# Altium schematic sheet SAM_E54_Xplained_Pro_Ethernet.SchDoc: Ethernet
size A3; Organization: ATMEL Norway; Address1: Vestre Rosten 79; Address2: N-7075 TILLER; Address3: NORWAY; DocumentNumber: A09-2748; Revision: 4; SheetNumber: 7; SheetTotal: 13; PageSetup: Record=PageOptions|CenterHorizontal=True|CenterVertical=True|PrintScale=1.04|XCorrection=1.00|YCorrection=1.00|PrintKind=1|BorderSize=5000000|LeftOffset=0|BottomOffset=0|Orientation=2|PaperLength=1000|PaperWidth=1000|Scale=100|PaperSource=7|PrintQuality=-4|MediaType=1|DitherType=10|PrintScaleMode=1|PaperKind=A3 (297 x 420 mm)|PaperIndex=8
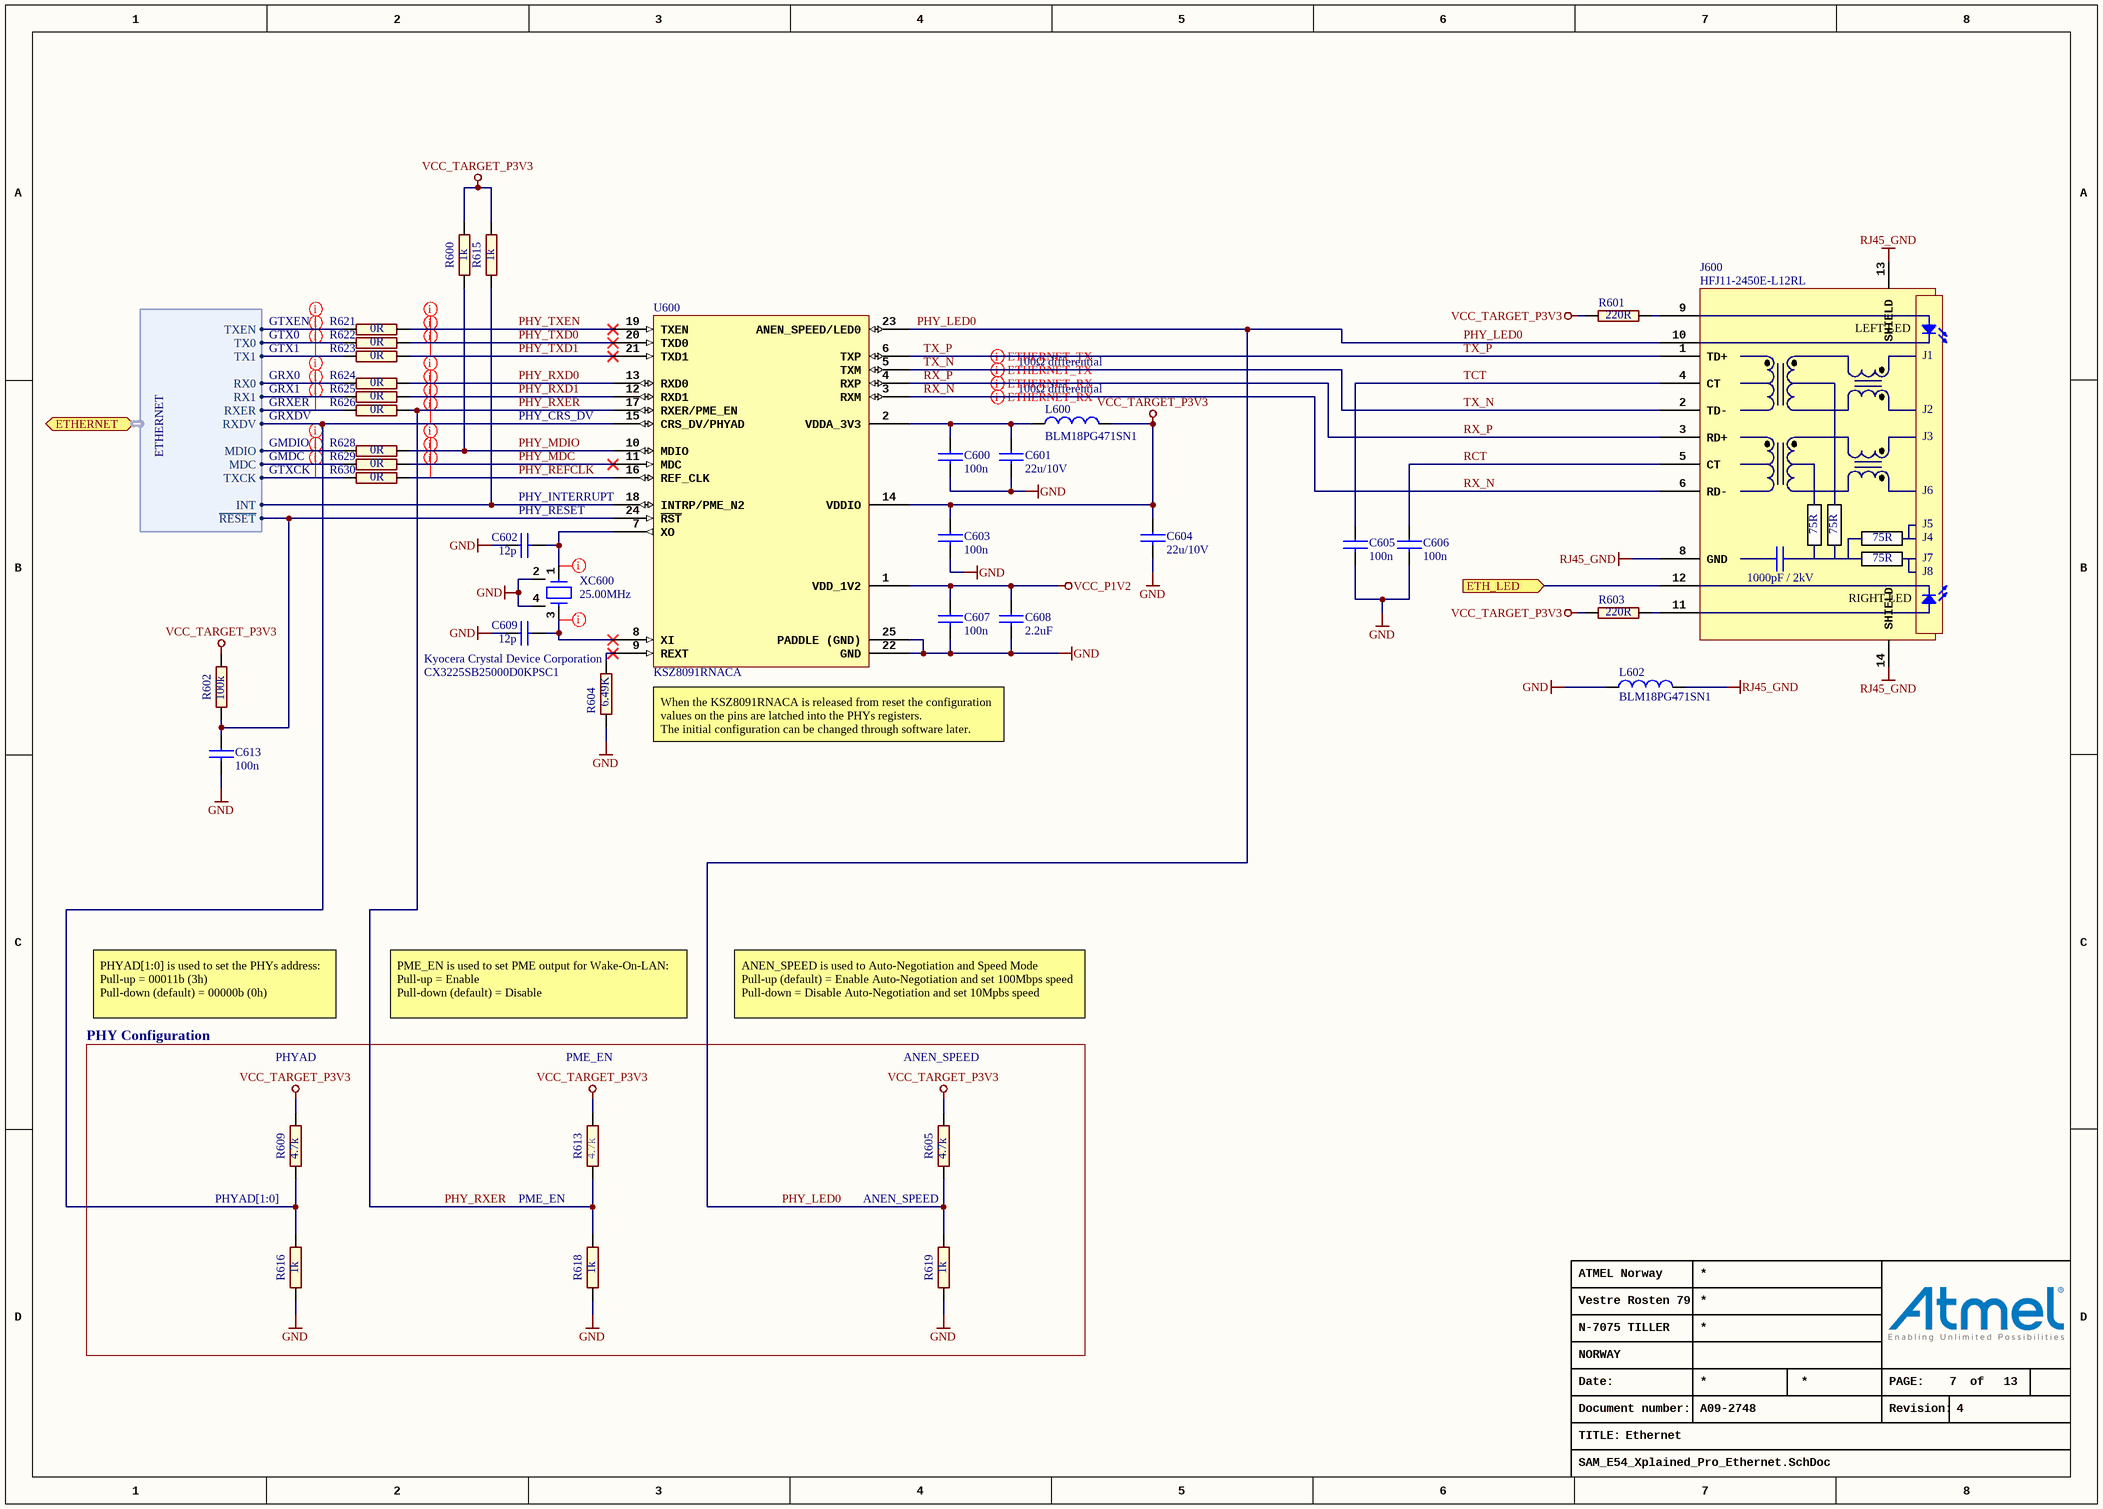
[diagram p0: SAM_E54_Xplained_Pro_Ethernet.SchDoc]

## Parts
C600  value 100n  [AP1-00053]
C601  value 22u/10V  [AP1-00117]
C602  value 12p  [AP1-00053]
C603  value 100n  [AP1-00053]
C604  value 22u/10V  [AP1-00117]
C605  value 100n  [AP1-00053]
C606  value 100n  [AP1-00053]
C607  value 100n  [AP1-00053]
C608  value 2.2uF  [AP1-00053]  (hidden comment: Farnell no: 1288200)
C609  value 12p  [AP1-00053]
C613  value 100n  [AP1-00053]
J600  value HFJ11-2450E-L12RL  [AP8-01033]
L600  value BLM18PG471SN1  [AP3-00005]
L602  value BLM18PG471SN1  [AP3-00005]
R600  value 1k  [AP2-00011]
R601  value 220R  [AP2-00011]
R602  value 100k  [AP2-00011]
R603  value 220R  [AP2-00011]
R604  value 6.49K  [AP2-00011]
R605  value 4.7k  [AP2-00011]
R609  value 4.7k  [AP2-00011]
R613  value 4.7k  [AP2-00011]
R615  value 1k  [AP2-00011]
R616  value 1k  [AP2-00011]
R618  value 1k  [AP2-00011]
R619  value 1k  [AP2-00011]
R621  value 0R  [AP2-00011]
R622  value 0R  [AP2-00011]
R623  value 0R  [AP2-00011]
R624  value 0R  [AP2-00011]
R625  value 0R  [AP2-00011]
R626  value 0R  [AP2-00011]
R628  value 0R  [AP2-00011]
R629  value 0R  [AP2-00011]
R630  value 0R  [AP2-00011]
U600  value KSZ8091RNACA  [AP6-00348]
XC600  value 25.00MHz  Manufacturer: Kyocera Crystal Device Corporation  MPN: CX3225SB25000D0KPSC1  [AP7-00061]

## Blocks framed on the sheet
PHY Configuration: R605 R609 R613 R616 R618 R619

## Ports
ETH_LED (in), ETHERNET (harness ETHERNET)

## Harnesses
ETHERNET: TX0, TX1, TXEN, TXCK, RX0, RX1, MDC, MDIO, RXER, RXDV, INT, ~{RESET}

## Nets
GND: C600.2 C601.2 C602.1 C603.2 C604.2 C605.2 C606.2 C607.2 C608.2 C609.1 C613.2 L602.1 R604.1 R616.1 R618.1 R619.1 U600.22(GND) U600.25(PADDLE_(GND)) XC600.2(GND) XC600.4(GND)
RJ45_GND: J600.8(GND) J600.13(SHIELD) J600.14(SHIELD) L602.2
VCC_P1V2: C607.1 C608.1 U600.1(VDD_1V2)
VCC_TARGET_P3V3: C603.1 C604.1 L600.1 R600.2 R601.2 R602.2 R603.2 R605.2 R609.2 R613.2 R615.2 U600.14(VDDIO)
ETH_LED: J600.12 ; port ETH_LED
PHY_LED0: J600.10 R605.1 R619.2 U600.23(ANEN_SPEED/LED0)
PHY_MDC: R629.1 U600.11(MDC)
PHY_MDIO: R600.1 R628.1 U600.10(MDIO)
PHY_REFCLK: R630.1 U600.16(REF_CLK)
PHY_RXD0: R624.1 U600.13(RXD0)
PHY_RXD1: R625.1 U600.12(RXD1)
PHY_RXER: R613.1 R618.2 R626.1 U600.17(RXER/PME_EN)
PHY_TXD0: R622.1 U600.20(TXD0)
PHY_TXD1: R623.1 U600.21(TXD1)
PHY_TXEN: R621.1 U600.19(TXEN)
RCT: C606.1 J600.5(CT)
RX_N: J600.6(RD-) U600.3(RXM)
RX_P: J600.3(RD+) U600.4(RXP)
TCT: C605.1 J600.4(CT)
TX_N: J600.2(TD-) U600.5(TXM)
TX_P: J600.1(TD+) U600.6(TXP)
NetC600_1: C600.1 C601.1 L600.2 U600.2(VDDA_3V3)
NetC602_2: C602.2 U600.7(XO) XC600.1(IN)
NetC609_2: C609.2 U600.8(XI) XC600.3(OUT)
NetC613_1: C613.1 R602.1 U600.24(~{RST}) ; port ETHERNET.~{RESET}
NetJ600_9: J600.9 R601.1
NetJ600_11: J600.11 R603.1
NetR604_2: R604.2 U600.9(REXT)
NetR609_1: R609.1 R616.2 U600.15(CRS_DV/PHYAD) ; port ETHERNET.RXDV
NetR615_1: R615.1 U600.18(INTRP/PME_N2) ; port ETHERNET.INT
NetR621_2: R621.2 ; port ETHERNET.TXEN
NetR622_2: R622.2 ; port ETHERNET.TX0
NetR623_2: R623.2 ; port ETHERNET.TX1
NetR624_2: R624.2 ; port ETHERNET.RX0
NetR625_2: R625.2 ; port ETHERNET.RX1
NetR626_2: R626.2 ; port ETHERNET.RXER
NetR628_2: R628.2 ; port ETHERNET.MDIO
NetR629_2: R629.2 ; port ETHERNET.MDC
NetR630_2: R630.2 ; port ETHERNET.TXCK

## Layout directives
differential pair: RX_N, RX_P, TX_N, TX_P
rule Assembly Testpoint Usage [Testpoint - Not Allowed    Multiple - Not Allowed]; rule Fabrication Testpoint Usage [Testpoint - Not Allowed    Multiple - Not Allowed]: NetC602_2, NetC609_2
net class ETHERNET: NetR609_1, NetR621_2, NetR622_2, NetR623_2, NetR624_2, NetR625_2, NetR626_2, NetR628_2, NetR629_2, NetR630_2, PHY_MDC, PHY_MDIO, PHY_REFCLK, PHY_RXD0, PHY_RXD1, PHY_RXER, PHY_TXD0, PHY_TXD1, PHY_TXEN

## Notes on the sheet
- GTXEN
- GTX0
- GTX1
- GRX0
- 100Ω differential
- GRX1
- GRXER
- GMDIO
- GRXDV
- PHY_CRS_DV
- (near L600) 100Ω differential
- GMDC
- GTXCK
- PHY_INTERRUPT
- (near C602) PHY_RESET
- When the KSZ8091RNACA is released from reset the configuration values on the pins are latched into the PHYs registers.
  The initial configuration can be changed through software later.
- PHYAD[1:0] is used to set the PHYs address:
  Pull-up = 00011b (3h)
  Pull-down (default) = 00000b (0h)
- PME_EN is used to set PME output for Wake-On-LAN:
  Pull-up = Enable
  Pull-down (default) = Disable
- ANEN_SPEED is used to Auto-Negotiation and Speed Mode
  Pull-up (default) = Enable Auto-Negotiation and set 100Mbps speed
  Pull-down = Disable Auto-Negotiation and set 10Mpbs speed
- PHYAD
- PME_EN
- ANEN_SPEED
- PHYAD[1:0]
- Date:
- PAGE:
- of
- TITLE:
- Document number:
- Revision:
- (in symbol A08-2651) LEFT LED; J1; J2; J3; J6; 75R; J5; J4; J7; J8; 1000pF / 2kV; RIGHT LED

## Library data of the parts
C600 C603 C605-C607 C613 = A01-0246: Ceramic capacitor, SMD 0402, X7R, 16V, +/-10%; PartGroup: Capacitors,Ceramic,SMD 0402; Manufacturer: Kemet; MPN: C0402C104K4RACTU; TemperatureRange: -55 - +125 deg C; AN: A01-0246; Tolerance: 16V, +/-10%; Height: 0,5
C601 C604 = A01-0791: Ceramic capacitor, SMD 0603, X5R,10V, Â±20%; PartGroup: Capacitors,Ceramic,SMD 0603; Manufacturer: Murata; MPN: GRM188R61A226ME15D; AN: A01-0791; Tolerance: Â±20%
C602 C609 = A01-0016: Ceramic capacitor, SMD 0402, NP0, 50V, +/-5%; PartGroup: Capacitors,Ceramic,SMD 0402; Manufacturer: Kemet; MPN: C0402C120J5GAC7867; TemperatureRange: -55 - +125 deg C; AN: A01-0016; Tolerance: 50V, +/-5%; Height: 0,550000011920929
C608 = A01-0300: Ceramic capacitor, SMD 0402, X5R, 6.3V, +/-20%; PartGroup: Capacitors,Ceramic,SMD 0402; Manufacturer: Kemet; MPN: C0402C225M9PAC; Tolerance: Â±20%; TemperatureRange: -55Â°C to +85Â°C; AN: A01-0300; Height: 0,5
J600 = A08-2651: 10/100Base-TX, THT, RJ45, green and yellow LEDs, integrated magnetics; PartGroup: Mechanical devices,Connectors,Other; Manufacturer: Halo Electronis; TemperatureRange: 0 C to + 70 C; AN: A08-2651; MPN: HFJ11-2450E-L12RL
L600 L602 = A03-0035: SMD RF inductor 0603. Z=470Ohm (@100MHz), Max R(dc)=0.65Ohm, Max current=1A; PartGroup: Inductors,EMI; Manufacturer: Murata; TemperatureRange: -55; AN: A03-0035; Height: 0,800000011920929; MPN: BLM18PG471SN1
R600 R615 R616 R618 R619 = A02-0212: Thick film resistor, SMD 0402, 1/16W, 1%; PartGroup: Resistors,SMD,0402 1%; Manufacturer: ASJ; MPN: CR10-1001-FK; TemperatureRange: -55 - +125 deg C; AN: A02-0212; Tolerance: 1 %; Height: 0,349999994039536
R601 R603 = A02-0196: Thick film resistor, SMD 0402, 1/16W, 1%; PartGroup: Resistors,SMD,0402 1%; Manufacturer: ASJ; MPN: CR10-2200-FK; TemperatureRange: -55 - +125 deg C; AN: A02-0196; Tolerance: 1 %; Height: 0,349999994039536
R602 = A02-0260: Thick film resistor, SMD 0402, 1/16W, 1%; PartGroup: Resistors,SMD,0402 1%; Manufacturer: ASJ; MPN: CR10-1003-FK; TemperatureRange: -55ï¿½ to +125ï¿½C; AN: A02-0260; Tolerance: 1 %; Height: 0,349999994039536
R604 = A02-0761: Thick film resistor, SMD 0402, 1/16W, 1%, E48; PartGroup: Resistors,SMD,0402 1%; Manufacturer: PHYCOMP; MPN: 232270676492L; TemperatureRange: -55 - +125 deg C; AN: A02-0761; Tolerance: 1%; Height: 0,349999994039536
R605 R609 R613 = A02-0228: Thick film resistor, SMD 0402, 1/16W, 1%; PartGroup: Resistors,SMD,0402 1%; Manufacturer: PHYCOMP; MPN: 2322 706 74702L; TemperatureRange: -55ï¿½ to +125ï¿½C; AN: A02-0228; Tolerance: 1 %; Height: 0,349999994039536
R621-R626 R628-R630 = A02-0163: RES 0.0 OHM 1/16W 0402 SMD; PartGroup: Resistors,SMD,0402 1%; Manufacturer: (n/a); MPN: RMCF0402ZT0R00; Tolerance: 1 %; TemperatureRange: -55 - +125 deg C; AN: A02-0163; Height: 0,349999994039536
U600 = A06-1460: 10Base-T/100Base-TX PHY, RMII, EEE, WOL, 50MHz clock output; PartGroup: Integrated Circuits,Interface ICs,Ethernet; Manufacturer: Microchip; TemperatureRange: 0 to +70 deg C; AN: A06-1460; Height: 0,850000023841858; MPN: KSZ8091RNACA
XC600 = A07-0149: Kyocera CX3225SB, 25MHz, 8pF, AEC-Q200, SMD crystal; PartGroup: Frequency devices,Crystals,SMD; Tolerance: Â±30ppm; TemperatureRange: -40Â°C to +85Â°C; AN: A07-0149; Height: 0,550000011920929